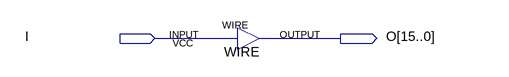
[diagram p0: schematic sheet]
// Quartus schematic Extend16bit.bdf as structural Verilog: 1 symbols, 2 pins
module Extend16bit (
  input  I,
  output [15:0] O
);

  assign O = {16{I}};  // WIRE WIRE
endmodule
